# EAGLE design MrBoosty (EAGLE 7.7.0)
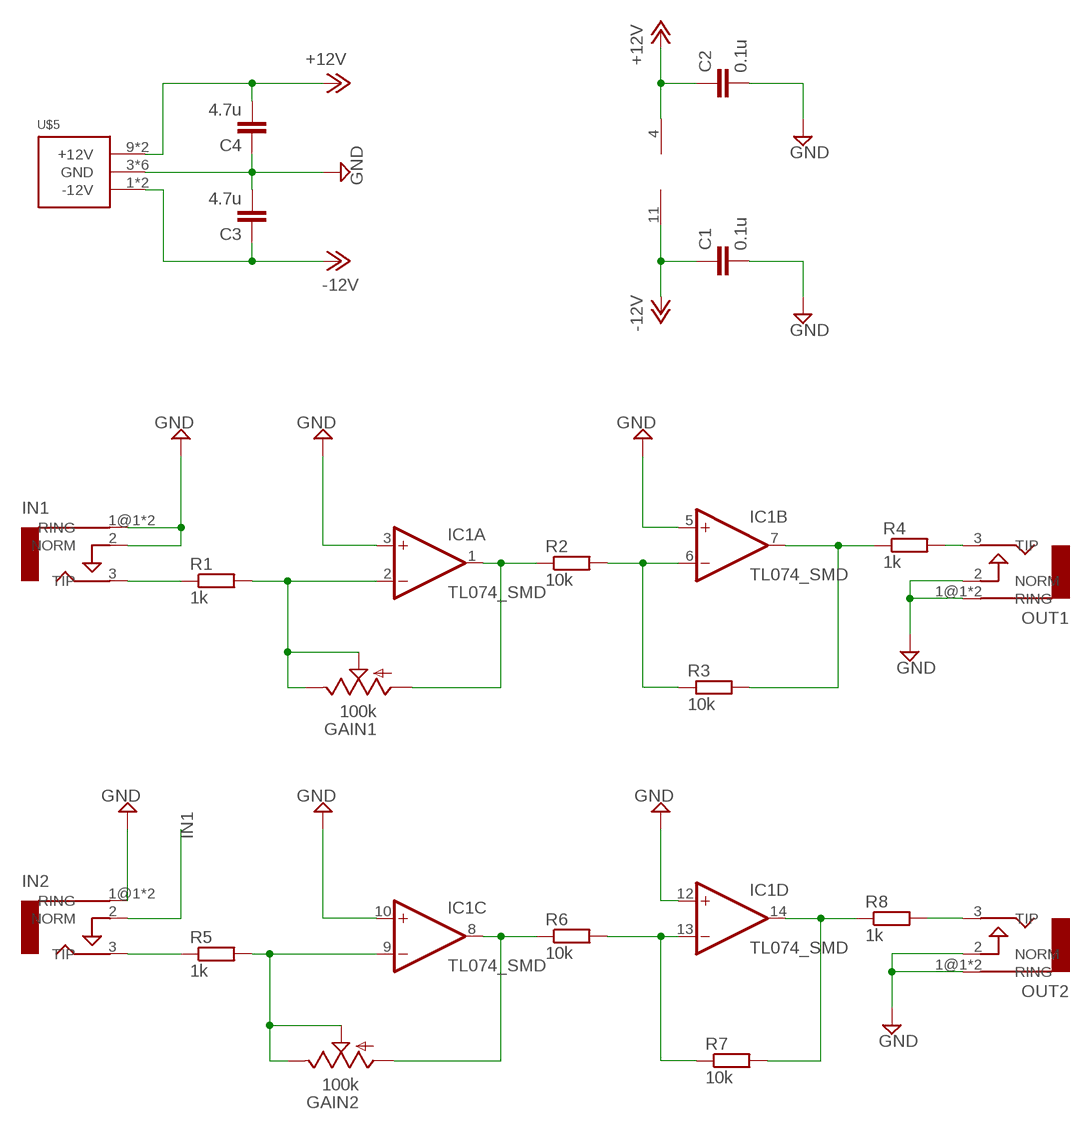
[diagram p0: schematic, sheet 1]

## Parts
C1  0.1u  C-EUC0805  [C0805]
C2  0.1u  C-EUC0805  [C0805]
C3  4.7u  C-EUC0805  [C0805]
C4  4.7u  C-EUC0805  [C0805]
GAIN1  100k  9MM_SNAP-IN_POT_  [9MM_SNAP-IN_POT]
GAIN2  100k  9MM_SNAP-IN_POT_  [9MM_SNAP-IN_POT]
IC1  TL074_SMD  [SO14]
IN1  AUDIO-JACKERTHENVAR  [ERTHENVAR-JACK]
IN2  AUDIO-JACKERTHENVAR  [ERTHENVAR-JACK]
OUT1  AUDIO-JACKERTHENVAR  [ERTHENVAR-JACK]
OUT2  AUDIO-JACKERTHENVAR  [ERTHENVAR-JACK]
R1  1k  R-EU_R0805  [R0805]
R2  10k  R-EU_R0805  [R0805]
R3  10k  R-EU_R0805  [R0805]
R4  1k  R-EU_R0805  [R0805]
R5  1k  R-EU_R0805  [R0805]
R6  10k  R-EU_R0805  [R0805]
R7  10k  R-EU_R0805  [R0805]
R8  1k  R-EU_R0805  [R0805]
U$5  POWER_SIMPLE10  [POWER_10]

## Nets
+12V: C2.1 C4.2 IC1.4(P:V+) U$5.9(+12V) U$5.10(+12V)
-12V: C1.1 C3.1 IC1.11(P:V-) U$5.1(-12V) U$5.2(-12V)
GND: C1.2 C2.2 C3.2 C4.1 IC1.3(A:+IN) IC1.5(B:+IN) IC1.10(C:+IN) IC1.12(D:+IN) IN1.1@1(RING) IN1.1@2(RING) IN1.2(NORM) IN2.1@1(RING) IN2.1@2(RING) OUT1.1@1(RING) OUT1.1@2(RING) OUT1.2(NORM) OUT2.1@1(RING) OUT2.1@2(RING) OUT2.2(NORM) U$5.3(GND) U$5.4(GND) U$5.5(GND) U$5.6(GND) U$5.7(GND) U$5.8(GND)
IN1: IN1.3(TIP) IN2.2(NORM) R1.1
IN2: IN2.3(TIP) R5.1
N$2: GAIN1.2(S) GAIN1.3(E) IC1.2(A:-IN) R1.2
N$3: GAIN1.1(A) IC1.1(A:OUT) R2.1
N$4: IC1.6(B:-IN) R2.2 R3.1
N$5: IC1.7(B:OUT) R3.2 R4.1
N$12: GAIN2.2(S) GAIN2.3(E) IC1.9(C:-IN) R5.2
N$13: GAIN2.1(A) IC1.8(C:OUT) R6.1
N$14: IC1.13(D:-IN) R6.2 R7.1
N$15: IC1.14(D:OUT) R7.2 R8.1
OUT1: OUT1.3(TIP) R4.2
OUT2: OUT2.3(TIP) R8.2

## Library data of the parts
C1-C4 = rcl:C-EU: CAPACITOR, European symbol
GAIN1 GAIN2 = MusicThingModular:9MM_SNAP-IN_POT: 9mm vertical snap-in pot, Alpha / Panasonic style
IC1 = MusicThingModular:TL074: Generic Quad Op Amp
IN1 IN2 OUT1 OUT2 = erthenvar:AUDIO-JACK: Switching Mono 3.5mm Audio Jack from Erthenvar.
R1-R8 = rcl:R-EU_: RESISTOR, European symbol
U$5 = eurorack:POWER_SIMPLE

## Board
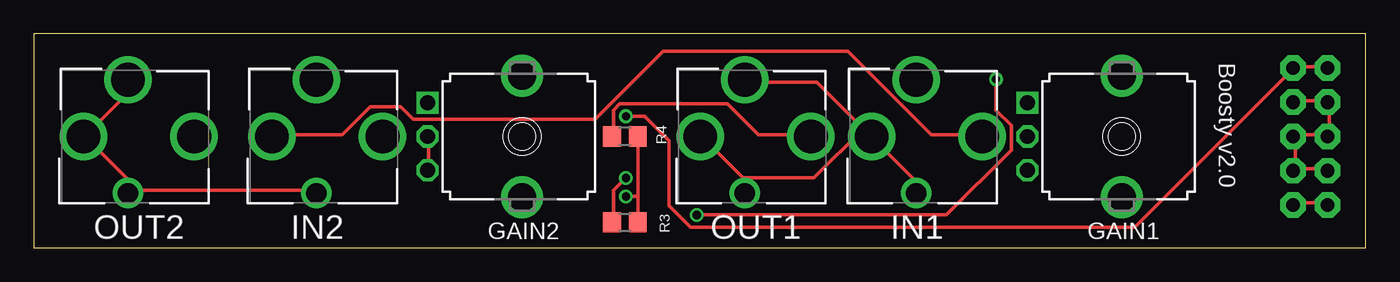
[diagram p1: board, top side]
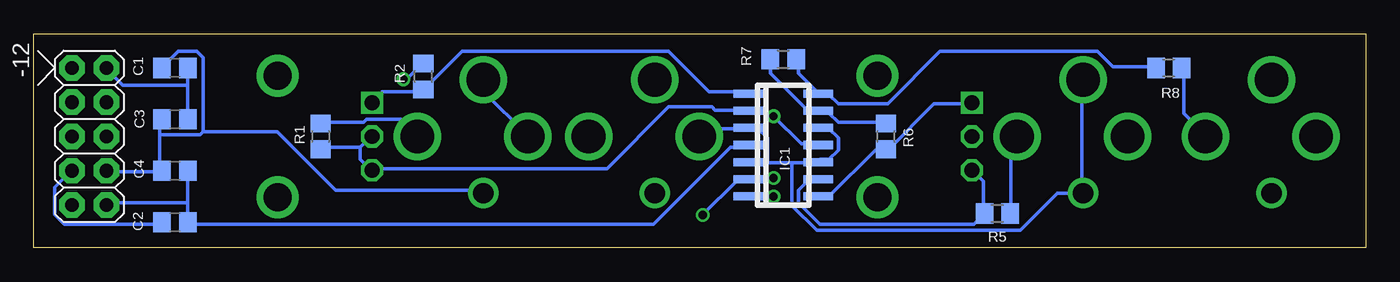
[diagram p2: board, bottom side, seen from below]

Size 98.73 x 15.87 mm. Coordinates in mm from the lower left corner, seen from the top.
Outline: 0,0 98.73,0 98.73,15.87 0,15.87 0,0
Copper layers (1*16): Top 0.035mm / dielectric 1.5mm / Bottom 0.035mm
Design rules "default": minimum track width 10mil, minimum drill 24mil, track to track 8mil, track to pad 8mil, pad to pad 8mil, via to via 8mil, smd to smd 8mil, copper to edge 40mil, drill to drill 8mil, minimum pad ring 10mil, minimum via ring 8mil, stop-mask expansion 4mil, vias tented up to drill 0mil, thermal gap 10mil

### Footprints (pad centres in the part's own frame; a part is rotated, then mirrored left to right if it is on the bottom)
C0805 = smd 1.3 x 1.5: 1 -0.95,0; 2 0.95,0
9MM_SNAP-IN_POT = drill 1.1 square: 1 -2.5,-7 | drill 1.1 octagon: 2 0,-7; 3 2.5,-7 | drill 2.1 pad 2.794: CHASSIS1 -4.5,0; CHASSIS2 4.5,0
SO14 = smd 0.6 x 2.2: 1 -3.81,-2.6; 2 -2.54,-2.6; 3 -1.27,-2.6; 4 0,-2.6; 5 1.27,-2.6; 6 2.54,-2.6; 7 3.81,-2.6; 8 3.81,2.6; 9 2.54,2.6; 10 1.27,2.6; 11 0,2.6; 12 -1.27,2.6; 13 -2.54,2.6; 14 -3.81,2.6
ERTHENVAR-JACK = drill 2.5: 1@1 -4.2,0; 2 0,-3.3; 3 0,4.9 | drill 1.5: 1@2 4.2,0
R0805 = smd 1.3 x 1.5: 1 -0.95,0; 2 0.95,0
POWER_10 = drill 1.016 pad 1.88 octagon: 1 -5.08,-1.27; 2 -5.08,1.27; 3 -2.54,-1.27; 4 -2.54,1.27; 5 0,-1.27; 6 0,1.27; 7 2.54,-1.27; 8 2.54,1.27; 9 5.08,-1.27; 10 5.08,1.27

### Placement (x,y rotation side)
C1  88.27,13.34 180 bottom
C2  88.27,1.91 180 bottom
C3  88.27,9.53 180 bottom
C4  88.27,5.71 0 bottom
GAIN1  80.64,8.26 270 top
GAIN2  36.2,8.26 270 top
IC1  43.18,7.62 270 bottom
IN1  65.41,8.26 270 top
IN2  20.95,8.26 270 top
OUT1  52.7,8.26 270 top
OUT2  6.99,8.26 270 top
R1  77.47,8.26 270 bottom
R2  69.85,12.7 90 bottom
R3  43.81,1.91 0 top
R4  43.81,8.26 180 top
R5  27.3,2.54 180 bottom
R6  35.56,8.26 90 bottom
R7  43.18,13.97 0 bottom
R8  14.61,13.34 0 bottom
U$5  94.61,8.26 270 bottom

### Tracks (layer width: path | path; a pad name or v marks a point on that pad's centre or on a via)
+12V
  Top 0.254: U$5.10 93.5,3.35 95.78,3.35 U$5.9
  Bottom 0.254: 87.33,3.35 87.33,5.64 C4.2 | 87.33,3.35 87.33,1.98 C2.1 87.1,1.75 52.81,1.75 47.09,7.47 45.95,7.47 IC1.4 | 87.33,3.35 93.27,3.35 U$5.10
-12V  (via drill 0.61)
  Top 0.254: v43.89,9.75 45.26,9.75 47.09,7.92 47.09,3.12 48.69,1.52 81.61,1.52 93.27,13.18 U$5.2 93.5,13.41 95.78,13.41 U$5.1
  Bottom 0.254: 87.33,12.04 87.33,13.18 C1.1 | 87.33,12.04 87.33,9.53 C3.1 | v43.89,9.75 41.83,7.7 40.69,7.7 IC1.11 | 87.33,12.04 92.13,12.04 93.27,13.18 U$5.2
GND
  Top 0.254: OUT2.1@1 6.86,12.27 6.86,11.35 3.89,8.38 OUT2.2 3.89,8.15 6.86,5.18 6.86,4.27 OUT2.1@2 7.09,4.27 20.8,4.27 IN2.1@2 | 52.58,5.18 52.58,4.27 OUT1.1@2 | 52.58,5.18 49.61,8.15 OUT1.2 | U$5.4 93.5,10.9 95.78,10.9 U$5.3 96.01,10.67 96.01,8.38 U$5.5 95.78,8.38 93.5,8.38 U$5.6 93.5,8.15 93.5,5.87 | 93.5,5.87 95.78,5.87 U$5.7 | 93.5,5.87 U$5.8 | IN1.1@2 65.38,4.27 65.38,4.95 62.18,8.15 IN1.2 | 61.49,8.84 61.95,8.38 IN1.2 | 61.49,8.84 58.06,12.27 52.81,12.27 OUT1.1@1 | 52.58,5.18 57.84,5.18 61.49,8.84 | 61.49,8.84 IN1.2
  Bottom 0.254: IN2.1@1 21.03,12.27 21.03,4.27 IN2.1@2 21.03,4.04 22.86,4.04 25.6,1.3 40.69,1.3 42.52,3.12 42.52,6.33 | 44.35,6.33 45.72,6.33 IC1.5 | 44.35,6.33 42.52,6.33 | 42.52,6.33 40.69,6.33 IC1.10 40.46,6.55 39.78,6.55 39.09,7.24 39.09,8.15 39.78,8.84 40.46,8.84 IC1.12 | OUT1.2 49.38,8.38 48.92,8.84 45.95,8.84 IC1.3 45.72,8.84 45.03,8.84 44.35,8.15 44.35,6.33 | 89.38,8.38 89.38,9.53 C3.2 | 89.38,8.38 89.38,5.87 C4.1 89.38,5.64 93.27,5.64 U$5.8 | 86.18,8.61 86.18,14.1 86.64,14.55 88.01,14.55 89.15,13.41 C1.2 | 86.18,8.61 86.41,8.38 89.38,8.38 | C2.2 89.38,1.75 96.47,1.75 97.16,2.44 97.16,4.5 96.01,5.64 U$5.7 | IN1.1@1 65.38,12.27 65.38,11.58 62.18,8.38 IN1.2 | 86.18,8.61 80.7,8.61 76.35,4.27 65.61,4.27 IN1.1@2
IN1
  Top 0.254: IN2.2 17.83,8.38 22.86,8.38 24.92,10.44 27.2,10.44 28.12,9.53 41.6,9.53 46.63,14.55 60.35,14.55 66.52,8.38 70.18,8.38 IN1.3
  Bottom 0.254: R1.1 77.27,9.3 74.3,9.3 74.07,9.53 71.55,9.53 70.41,8.38 IN1.3
IN2
  Bottom 0.254: R5.1 26.29,2.67 26.29,7.92 26.06,8.15 IN2.3
N$2
  Bottom 0.254: 74.52,7.47 77.27,7.47 R1.2 | 74.52,7.47 73.84,8.15 GAIN1.2 | IC1.2 45.95,10.21 48.23,10.21 48.46,10.44 51.66,10.44 56.24,5.87 73.61,5.87 GAIN1.3 73.84,5.87 74.52,6.55 74.52,7.47
N$3
  Bottom 0.254: GAIN1.1 73.61,10.9 72.92,11.58 69.95,11.58 R2.1 69.72,11.81 66.98,14.55 51.66,14.55 48.69,11.58 45.95,11.58 IC1.1
N$4  (via drill 0.61)
  Top 0.254: v43.89,5.18 42.98,4.27 42.98,1.98 R3.1 | v71.32,12.5 71.32,10.21 72.47,9.07 72.47,7.24 67.67,2.44 v49.15,2.44
  Bottom 0.254: v43.89,5.18 45.72,5.18 IC1.6 45.95,4.95 46.63,4.95 v49.15,2.44 | v71.32,12.5 71.09,12.5 69.95,13.64 R2.2
N$5  (via drill 0.61)
  Top 0.254: 44.81,3.81 44.81,8.15 R4.1 | 44.81,3.81 44.81,1.98 R3.2 | 44.81,3.81 v43.89,3.81
  Bottom 0.254: v43.89,3.81 IC1.7
N$12
  Top 0.254: GAIN2.2 29.26,8.15 29.26,5.87 GAIN2.3
  Bottom 0.254: GAIN2.3 29.03,5.64 28.35,4.95 28.35,2.67 R5.2 28.35,2.44 29.03,1.75 40.46,1.75 42.06,3.35 42.06,4.27 41.38,4.95 40.69,4.95 IC1.9
N$13
  Bottom 0.254: IC1.8 39.78,3.81 36.35,7.24 35.66,7.24 R6.1 35.43,7.24 32,10.67 29.26,10.67 GAIN2.1
N$14
  Bottom 0.254: R6.2 35.66,9.3 39.09,9.3 39.78,9.98 40.46,9.98 IC1.13 40.69,10.21 41.38,10.21 44.12,12.95 44.12,13.87 R7.1
N$15
  Bottom 0.254: R8.1 15.77,13.41 18.75,13.41 19.89,14.55 31.55,14.55 35.43,10.67 39.09,10.67 39.78,11.35 40.46,11.35 IC1.14 40.69,11.58 42.06,12.95 42.06,13.87 R7.2
OUT1
  Top 0.254: R4.2 42.98,8.38 42.98,10.21 43.43,10.67 51.44,10.67 53.72,8.38 57.38,8.38 OUT1.3
OUT2
  Bottom 0.254: R8.2 13.49,13.18 13.49,9.98 11.89,8.38 OUT2.3

### Text on the board
tNames: Boosty v2.0